# Altium project ECSE478 - DAQ Device.PrjPcb (part 3 of 4)

## Sheet Analog - High Speed DE.SchDoc: Analog - High Speed Differential
size B; DrawnBy: Jasper Yun; SheetNumber: 10; SheetTotal: 13; Competition: SAC 2021; Subteam: Avionics; University: McGill University; Location: Montreal, Quebec; Project: Avionics Project Name; MRT: McGill Rocket Team
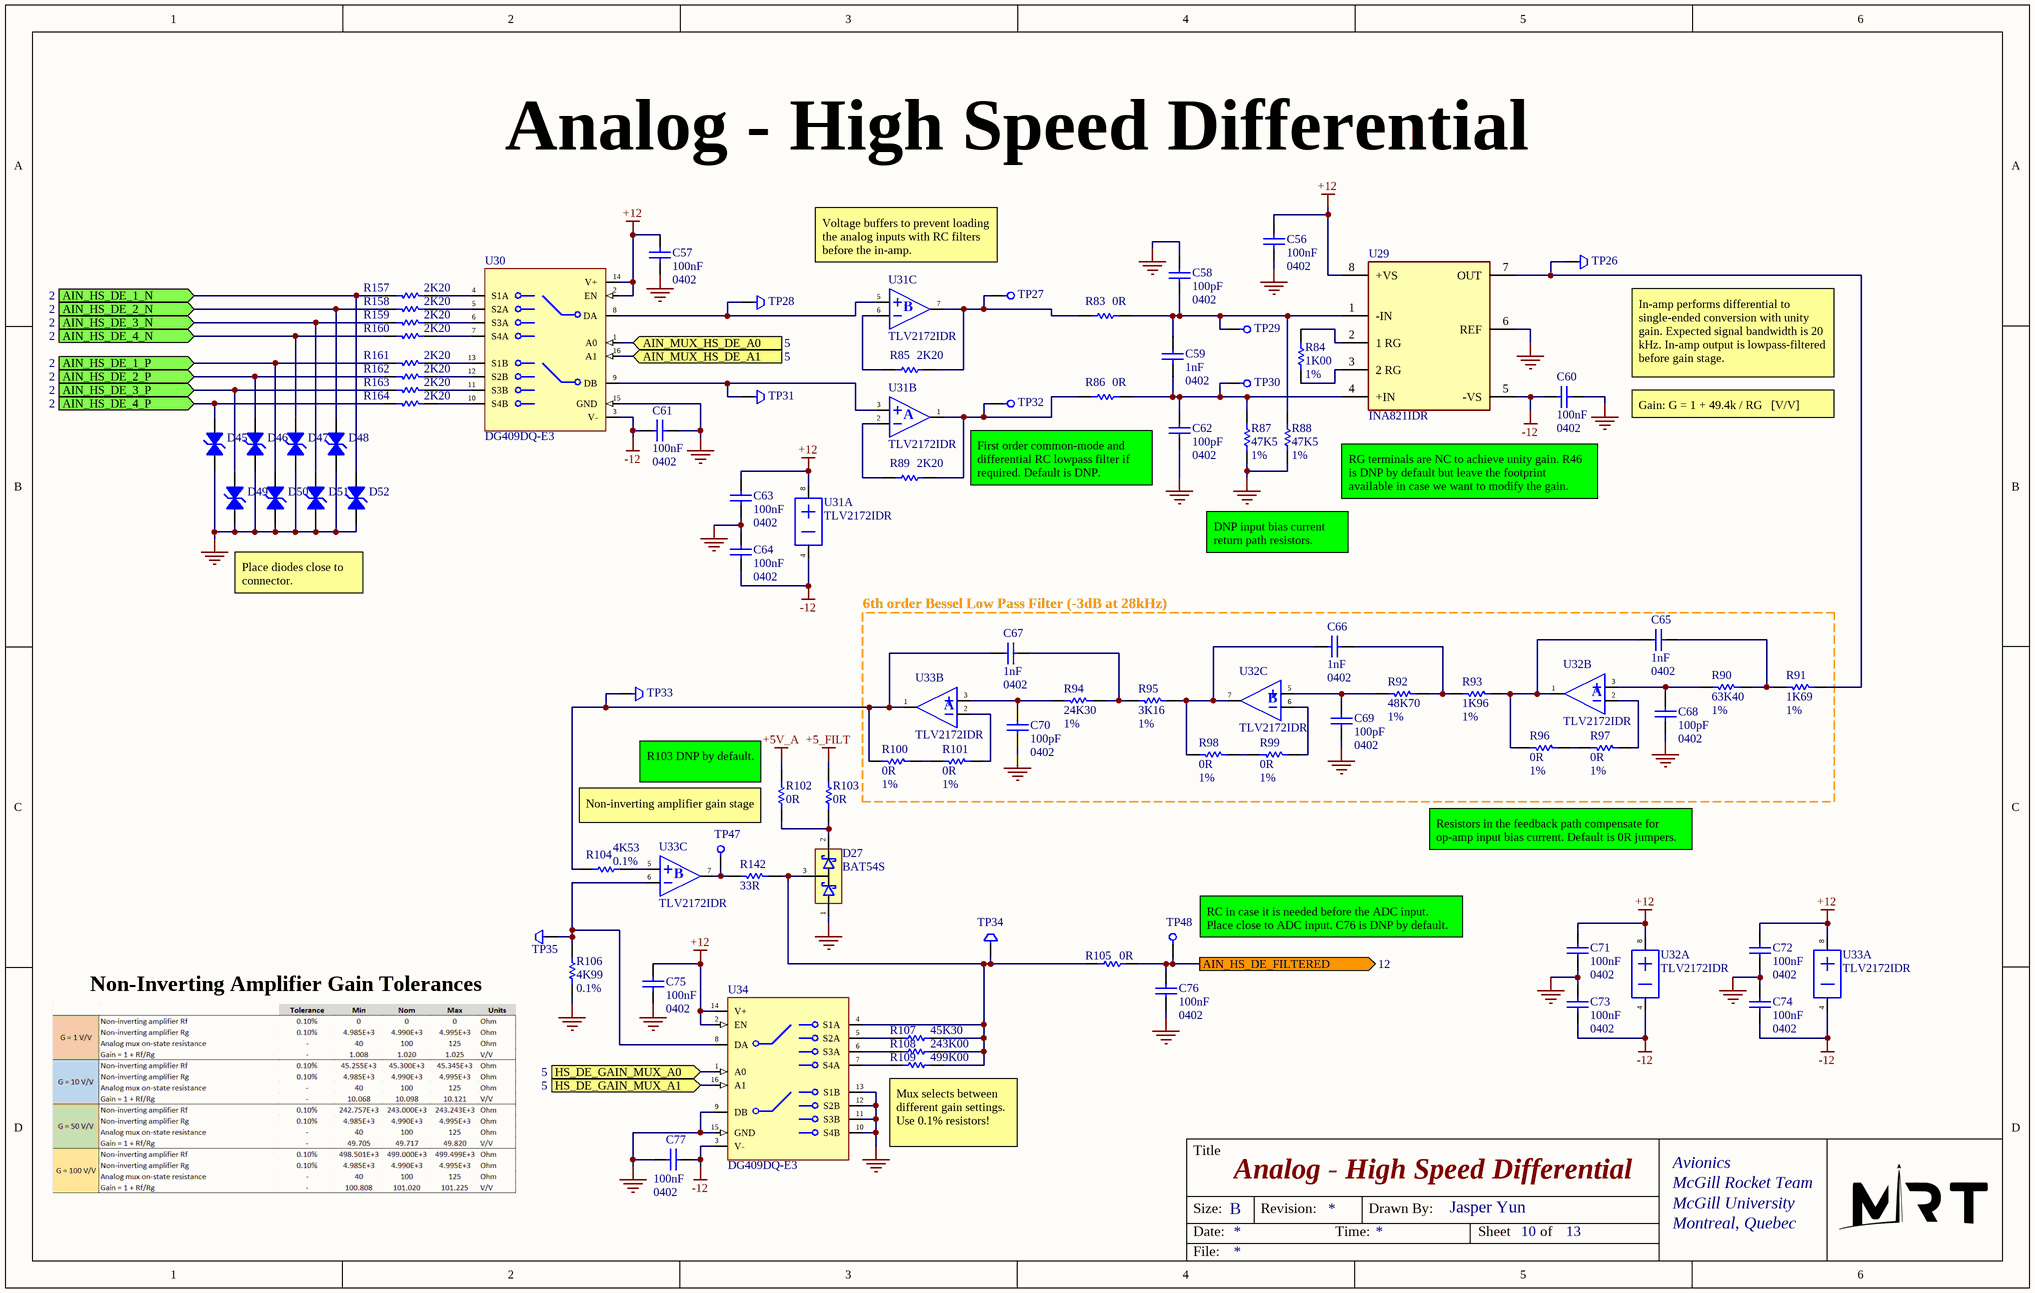
[diagram p9: Analog - High Speed DE.SchDoc]

### Parts
C56  100nF  value 0402  [0402 CAP]
C57  100nF  value 0402  [0402 CAP]
C58  100pF  value 0402  [0402 CAP]
C59  1nF  value 0402  [0402 CAP]
C60  100nF  value 0402  [0402 CAP]
C61  100nF  value 0402  [0402 CAP]
C62  100pF  value 0402  [0402 CAP]
C63  100nF  value 0402  [0402 CAP]
C64  100nF  value 0402  [0402 CAP]
C65  1nF  value 0402  [0402 CAP]
C66  1nF  value 0402  [0402 CAP]
C67  1nF  value 0402  [0402 CAP]
C68  100pF  value 0402  [0402 CAP]
C69  100pF  value 0402  [0402 CAP]
C70  100pF  value 0402  [0402 CAP]
C71  100nF  value 0402  [0402 CAP]
C72  100nF  value 0402  [0402 CAP]
C73  100nF  value 0402  [0402 CAP]
C74  100nF  value 0402  [0402 CAP]
C75  100nF  value 0402  [0402 CAP]
C76  100nF  value 0402  [0402 CAP]
C77  100nF  value 0402  [0402 CAP]
D27  BAT54S  [SOT23-3]
D45  D12V0L1B2LP-7B  [DFN1006-2]  (value not drawn)
D46  D12V0L1B2LP-7B  [DFN1006-2]  (value not drawn)
D47  D12V0L1B2LP-7B  [DFN1006-2]  (value not drawn)
D48  D12V0L1B2LP-7B  [DFN1006-2]  (value not drawn)
D49  D12V0L1B2LP-7B  [DFN1006-2]  (value not drawn)
D50  D12V0L1B2LP-7B  [DFN1006-2]  (value not drawn)
D51  D12V0L1B2LP-7B  [DFN1006-2]  (value not drawn)
D52  D12V0L1B2LP-7B  [DFN1006-2]  (value not drawn)
R83  0R  [0402 RES]
R84  1K00  value 1%  [0402 RES]
R85  2K20  [0402 RES]
R86  0R  [0402 RES]
R87  47K5  value 1%  [0402 RES]
R88  47K5  value 1%  [0402 RES]
R89  2K20  [0402 RES]
R90  63K40  value 1%  [0402 RES]
R91  1K69  value 1%  [0402 RES]
R92  48K70  value 1%  [0402 RES]
R93  1K96  value 1%  [0402 RES]
R94  24K30  value 1%  [0402 RES]
R95  3K16  value 1%  [0402 RES]
R96  0R  value 1%  [0402 RES]
R97  0R  value 1%  [0402 RES]
R98  0R  value 1%  [0402 RES]
R99  0R  value 1%  [0402 RES]
R100  0R  value 1%  [0402 RES]
R101  0R  value 1%  [0402 RES]
R102  0R  [0402 RES]
R103  0R  [0402 RES]
R104  4K53  value 0.1%  [0402 RES]
R105  0R  [0402 RES]
R106  4K99  value 0.1%  [0402 RES]
R107  45K30  [0402 RES]
R108  243K00  [0402 RES]
R109  499K00  [0402 RES]
R142  33R  [0402 RES]
R157  2K20  [0402 RES]
R158  2K20  [0402 RES]
R159  2K20  [0402 RES]
R160  2K20  [0402 RES]
R161  2K20  [0402 RES]
R162  2K20  [0402 RES]
R163  2K20  [0402 RES]
R164  2K20  [0402 RES]
TP26  Test Point - Keystone 5015  [Test Point Keystone 5015]  (value not drawn)
TP27  Test Point - SMD Pad  [TEST POINT SMD PAD]  (value not drawn)  (no BOM)
TP28  Test Point - Keystone 5015  [Test Point Keystone 5015]  (value not drawn)
TP29  Test Point - SMD Pad  [TEST POINT SMD PAD]  (value not drawn)  (no BOM)
TP30  Test Point - SMD Pad  [TEST POINT SMD PAD]  (value not drawn)  (no BOM)
TP31  Test Point - Keystone 5015  [Test Point Keystone 5015]  (value not drawn)
TP32  Test Point - SMD Pad  [TEST POINT SMD PAD]  (value not drawn)  (no BOM)
TP33  Test Point - Keystone 5015  [Test Point Keystone 5015]  (value not drawn)
TP34  Test Point - Keystone 5015  [Test Point Keystone 5015]  (value not drawn)
TP35  Test Point - Keystone 5015  [Test Point Keystone 5015]  (value not drawn)
TP47  Test Point - SMD Pad  [TEST POINT SMD PAD]  (value not drawn)  (no BOM)
TP48  Test Point - SMD Pad  [TEST POINT SMD PAD]  (value not drawn)  (no BOM)
U29  INA821IDR  [FP-D0008A-IPC_A]
U30  DG409DQ-E3  [TSSOP-16]
U31  TLV2172IDR  [SOIC-8]  (parts A,B,C of 3)
U32  TLV2172IDR  [SOIC-8]  (parts A,B,C of 3)
U33  TLV2172IDR  [SOIC-8]  (parts A,B,C of 3)
U34  DG409DQ-E3  [TSSOP-16]

### Blocks framed on the sheet
6th order Bessel Low Pass Filter (-3dB at 28kHz): C65-C70 R90-R101 U32 U33

### Ports
AIN_HS_DE_1_N (in, see 2), AIN_HS_DE_1_P (in, see 2), AIN_HS_DE_2_N (in, see 2), AIN_HS_DE_2_P (in, see 2), AIN_HS_DE_3_N (in, see 2), AIN_HS_DE_3_P (in, see 2), AIN_HS_DE_4_N (in, see 2), AIN_HS_DE_4_P (in, see 2), AIN_HS_DE_FILTERED (out, see 12), AIN_MUX_HS_DE_A0 (in, see 5), AIN_MUX_HS_DE_A1 (in, see 5), HS_DE_GAIN_MUX_A0 (in, see 5), HS_DE_GAIN_MUX_A1 (in, see 5)

### Nets
+5_FILT: R103.1
+5V_A: R102.1
+12: C56.2 C57.2 C63.2 C71.2 C72.2 C75.2 U29.8(+VS) U30.2(EN) U30.14(V+) U31.8(VCC+) U32.8(VCC+) U33.8(VCC+) U34.2(EN) U34.14(V+)
-12: C60.2 C61.2 C64.1 C73.1 C74.1 C77.2 U29.5(-VS) U30.3(V-) U31.4(VCC-) U32.4(VCC-) U33.4(VCC-) U34.3(V-)
GND: C56.1 C57.1 C58.2 C60.1 C61.1 C62.1 C63.1 C64.2 C68.1 C69.1 C70.1 C71.1 C72.1 C73.2 C74.2 C75.1 C76.1 C77.1 D27.1 D45.1 D46.1 D47.1 D48.1 D49.1 D50.1 D51.1 D52.1 R87.1 R88.1 R106.1 U29.6(REF) U30.15(GND) U34.9(DB) U34.10(S4B) U34.11(S3B) U34.12(S2B) U34.13(S1B) U34.15(GND)
AIN_HS_DE_1_N: D52.2 R157.1 ; port AIN_HS_DE_1_N
AIN_HS_DE_1_P: D50.2 R161.1 ; port AIN_HS_DE_1_P
AIN_HS_DE_2_N: D48.2 R158.1 ; port AIN_HS_DE_2_N
AIN_HS_DE_2_P: D46.2 R162.1 ; port AIN_HS_DE_2_P
AIN_HS_DE_3_N: D51.2 R159.1 ; port AIN_HS_DE_3_N
AIN_HS_DE_3_P: D49.2 R163.1 ; port AIN_HS_DE_3_P
AIN_HS_DE_4_N: D47.2 R160.1 ; port AIN_HS_DE_4_N
AIN_HS_DE_4_P: D45.2 R164.1 ; port AIN_HS_DE_4_P
AIN_HS_DE_FILTERED: C76.2 R105.1 TP48.1 ; port AIN_HS_DE_FILTERED
AIN_MUX_HS_DE_A0: U30.1(A0) ; port AIN_MUX_HS_DE_A0
AIN_MUX_HS_DE_A1: U30.16(A1) ; port AIN_MUX_HS_DE_A1
HS_DE_GAIN_MUX_A0: U34.1(A0) ; port HS_DE_GAIN_MUX_A0
HS_DE_GAIN_MUX_A1: U34.16(A1) ; port HS_DE_GAIN_MUX_A1
NetC58_1: C58.1 C59.2 R83.1 R88.2 TP29.1 U29.1(-IN)
NetC59_1: C59.1 C62.2 R86.1 R87.2 TP30.1 U29.4(+IN)
NetC65_1: C65.1 R93.1 R96.2 U32.1
NetC65_2: C65.2 R90.1 R91.2
NetC66_1: C66.1 R95.1 R98.2 U32.7
NetC66_2: C66.2 R92.1 R93.2
NetC67_1: C67.1 R100.2 R104.2 TP33.1 U33.1
NetC67_2: C67.2 R94.1 R95.2
NetC68_2: C68.2 R90.2 U32.3
NetC69_2: C69.2 R92.2 U32.5
NetC70_2: C70.2 R94.2 U33.3
NetD27_2: D27.2 R102.2 R103.2
NetD27_3: D27.3 R105.2 R107.1 R108.1 R109.1 R142.2 TP34.1 U34.4(S1A)
NetR83_2: R83.2 R85.1 TP27.1 U31.7
NetR84_1: R84.1 U29.3(2_RG)
NetR84_2: R84.2 U29.2(1_RG)
NetR85_2: R85.2 U31.6
NetR86_2: R86.2 R89.1 TP32.1 U31.1
NetR89_2: R89.2 U31.2
NetR91_1: R91.1 TP26.1 U29.7(OUT)
NetR96_1: R96.1 R97.2
NetR97_1: R97.1 U32.2
NetR98_1: R98.1 R99.2
NetR99_1: R99.1 U32.6
NetR100_1: R100.1 R101.2
NetR101_1: R101.1 U33.2
NetR104_1: R104.1 U33.5
NetR106_2: R106.2 TP35.1 U33.6 U34.8(DA)
NetR107_2: R107.2 U34.5(S2A)
NetR108_2: R108.2 U34.6(S3A)
NetR109_2: R109.2 U34.7(S4A)
NetR142_1: R142.1 TP47.1 U33.7
NetR157_2: R157.2 U30.4(S1A)
NetR158_2: R158.2 U30.5(S2A)
NetR159_2: R159.2 U30.6(S3A)
NetR160_2: R160.2 U30.7(S4A)
NetR161_2: R161.2 U30.13(S1B)
NetR162_2: R162.2 U30.12(S2B)
NetR163_2: R163.2 U30.11(S3B)
NetR164_2: R164.2 U30.10(S4B)
NetTP28_1: TP28.1 U30.8(DA) U31.5
NetTP31_1: TP31.1 U30.9(DB) U31.3

### Notes on the sheet
- Voltage buffers to prevent loading the analog inputs with RC filters before the in-amp.
- In-amp performs differential to single-ended conversion with unity gain. Expected signal bandwidth is 20 kHz. In-amp output is lowpass-filtered before gain stage.
- Gain: G = 1 + 49.4k / RG   [V/V]
- First order common-mode and differential RC lowpass filter if required. Default is DNP.
- RG terminals are NC to achieve unity gain. R46 is DNP by default but leave the footprint available in case we want to modify the gain.
- DNP input bias current return path resistors.
- Place diodes close to connector.
- (near R102) R103 DNP by default.
- Non-inverting amplifier gain stage
- Resistors in the feedback path compensate for op-amp input bias current. Default is 0R jumpers.
- (near TP48) RC in case it is needed before the ADC input. Place close to ADC input. C76 is DNP by default.
- Non-Inverting Amplifier Gain Tolerances
- (near R109) Mux selects between different gain settings.
  Use 0.1% resistors!
- Title
- Size:
- Date:
- B
- Revision:
- Time:
- Drawn By:
- Sheet
- of
- File:
- (in symbol OP AMP RC4580, part B) A
- (in symbol OP AMP RC4580, part C) B

### Library data of the parts
C56-C77 = Cap: Capacitor; Published: 8-Jun-2000; LatestRevisionDate: 17-Jul-2002; LatestRevisionNote: Re-released for DXP Platform.; PackageReference: RAD-0.3; Publisher: Altium Limited; PackageDescription: Radial Cap, Thru-Hole; 2 Leads; 0.3 in Pin Spacing
D27 = Schottky Diode Array BAT54S: Rectifier Diode Small Signal Schottky 40V 0.3A 5ns 3-Pin SOT-23 T/R; Manufacturer: STMicroelectronics; Manufacturer Part Number: BAT54SFILM; Forward Current: 300mA; Peak Non-Repetitive Surge Current: 1A; Forward Voltage: 900mV; Max Reverse Current: 100uA; Max Reverse Leakage Current: 1uA; Element Configuration: Single; Voltage Rating (DC): 30V; Supplier 1: Digi-Key; RoHS: Yes; Category: Rectifier Diodes; Stock 1: 2760; Pricing 1: 1=0.34000, 10=0.27800, 100=0.14730, 500=0.09694, 1000=0.06592 (USD); Mount: Surface Mount; Case/Package: SOT-23; Number of Pins: 3; Weight: 0.1lb; Min Operating Temperature: -40°C; Max Operating Temperature: 150°C; Reverse Recovery Time: 5ns; Max Repetitive Reverse Voltage (Vrrm): 40V; Packaging: Tape and Reel; Package Quantity: 3000; Average Rectified Current: 300mA; Max Forward Surge Current (Ifsm): 1A; Max Reverse Voltage (DC): 40V; Max Surge Current: 1A; Recovery Time: 5ns; Termination: SMD/SMT; Current Rating: 300mA; Length: 2.9mm; Width: 3.05mm; Height: 0.95mm; Radiation Hardening: No; REACH SVHC: No SVHC; RoHS Compliant: Yes; Lead Free: Lead Free; ComponentLink1URL: https://datasheet.ciiva.com/1200/1689724-1200683.pdf?src-supplier=Farnell; ComponentLink1Description: https://datasheet.ciiva.com/1200/1689724-1200683.pdf?src-supplier=Farnell; ComponentLink2URL: https://datasheet.ciiva.com/1177/1689724-1177974.pdf?src-supplier=Element14; ComponentLink2Description: https://datasheet.ciiva.com/1177/1689724-1177974.pdf?src-supplier=Element14; ComponentLink3URL: https://datasheet.ciiva.com/1200/cd00001322-1200682.pdf?src-supplier=Farnell; ComponentLink3Description: https://datasheet.ciiva.com/1200/cd00001322-1200682.pdf?src-supplier=Farnell; ComponentLink4URL: https://datasheet.ciiva.com/14168/cd00001322-14168028.pdf?src-supplier=Distrelec; ComponentLink4Description: https://datasheet.ciiva.com/14168/cd00001322-14168028.pdf?src-supplier=Distrelec; ComponentLink5URL: https://datasheet.ciiva.com/905/cd00001322-905882.pdf?src-supplier=Digi-Key; ComponentLink5Description: https://datasheet.ciiva.com/905/cd00001322-905882.pdf?src-supplier=Digi-Key; ComponentLink6URL: https://datasheet.ciiva.com/905/cd00001322-905881.pdf?src-supplier=Digi-Key; ComponentLink6Description: https://datasheet.ciiva.com/905/cd00001322-905881.pdf?src-supplier=Digi-Key; ComponentLink7URL: https://datasheet.ciiva.com/905/cd00001322-905883.pdf?src-supplier=Digi-Key; ComponentLink7Description: https://datasheet.ciiva.com/905/cd00001322-905883.pdf?src-supplier=Digi-Key; ComponentLink8URL: https://datasheet.ciiva.com/1177/1689724-1177973.pdf?src-supplier=Element14; ComponentLink8Description: https://datasheet.ciiva.com/1177/1689724-1177973.pdf?src-supplier=Element14; Supplier Part Number 1: 497-2522-1-ND
D45-D52 = Diode Zener Bidirectional: Bidirectional Zener diode
R83 R85 R86 R89 R102 R103 R105 R107-R109 R142 R157-R164 = Res1: Resistor; Value: 1%; Published: 8-Jun-2000; LatestRevisionDate: 17-Jul-2002; LatestRevisionNote: Re-released for DXP Platform.; PackageReference: AXIAL-0.3; Publisher: Altium Limited; PackageDescription: Axial Device, Thru-Hole; 2 Leads; 0.3 in Pin Spacing
R84 R87 R88 R90-R101 R104 R106 = Res1: Resistor; Published: 8-Jun-2000; LatestRevisionDate: 17-Jul-2002; LatestRevisionNote: Re-released for DXP Platform.; PackageReference: AXIAL-0.3; Publisher: Altium Limited; PackageDescription: Axial Device, Thru-Hole; 2 Leads; 0.3 in Pin Spacing
TP26 TP28 TP31 TP33-TP35 = Test Point - Keystone 5015: Keystone 5015 Test point
TP27 TP29 TP30 TP32 TP47 TP48 = Test Point - SMD Pad: SMD Pad test point
U29 = CMP-04895-000157-1: IC INST AMP 1 CIRCUIT 8SOIC; RoHS Compliant: Yes
U30 U34 = Analog Mux DG409DQ-E3: DG409 Series 20 V 8-Ch/Dual 4-Ch High-Performance CMOS Analog Multiplexer; Manufacturer: Vishay Siliconix; Min Supply Voltage: 13V; Max Supply Voltage: 44V; Number of Inputs: 8; Number of Outputs: 2; Number of Channels: 4; Min Dual Supply Voltage: 5V; Max Dual Supply Voltage: 20V; Propagation Delay: 160ns; On-State Resistance: 90R; Operating Supply Current: 1uA; Turn-On Delay Time: 150ns; Max Power Dissipation: 600mW; Max Supply Current: 500uA; Supply Type: Dual,Single; Dual Supply Voltage: 15V; Operating Supply Voltage: 36V; Supplier 1: Mouser; Manufacturer Part Number: DG409DQ-E3; RoHS: Yes; Category: Decoders and Multiplexers; Stock 1: 4584; Pricing 1: 1=4.36000, 10=3.91000, 50=3.70000, 100=3.20000, 1000=2.73000, 10000=2.40000 (USD); Mount: Surface Mount; Case/Package: TSSOP; Number of Pins: 16; Weight: 0.006102oz; Min Operating Temperature: -40°C; Max Operating Temperature: 85°C; Package Quantity: 360; Packaging: Rail/Tube; Logic Function: Multiplexer; Turn-Off Delay Time: 150ns; Power Dissipation: 600mW; Series: -; Length: 5.07mm; Width: 4.4mm; Height: 0.92mm; Radiation Hardening: No; Lead Free: Lead Free; RoHS Compliant: Yes; ComponentLink1URL: https://datasheet.ciiva.com/1677/dg408-1677556.pdf?src-supplier=Digi-Key; ComponentLink1Description: https://datasheet.ciiva.com/1677/dg408-1677556.pdf?src-supplier=Digi-Key; ComponentLink2URL: https://datasheet.ciiva.com/2978/dg408-2978747.pdf?src-supplier=Avnet; ComponentLink2Description: https://datasheet.ciiva.com/2978/dg408-2978747.pdf?src-supplier=Avnet; Supplier Part Number 1: 78-DG409DQ-E3
U31-U33 = OP AMP RC4580: 2-channel, 12-MHz, low-noise, low-distortion audio op amp with high output current 8-SOIC -40 to 85; Manufacturer: Texas Instruments; Manufacturer Part Number: RC4580IDR; Min Supply Voltage: 4V; Max Supply Voltage: 32V; Max Dual Supply Voltage: 16V; Min Dual Supply Voltage: 2V; Voltage Gain: 110dB; Common Mode Rejection Ratio: 80dB; Nominal Gain Bandwidth Product: 12MHz; Number of Channels: 2; Slew Rate: 5V/µs; Max I/O Voltage: 3mV; Input Bias Current: 500nA; Operating Supply Current: 6mA; Output Current per Channel: 50mA; Nominal Supply Current: 4.5mA; Dual Supply Voltage: 9V; Load Impedance: 2kR; Supplier 1: Digi-Key; RoHS: Yes; Category: Amplifiers - Op Amps, Buffer, Instrumentation; Stock 1: 3503; Pricing 1: 1=0.46000, 10=0.37400, 25=0.34200, 100=0.25460, 250=0.23072, 500=0.19092, 1000=0.14320 (USD); Case/Package: D; Number of Pins: 8; Weight: 0.002561oz; Contact Plating: Gold; Min Operating Temperature: -40°C; Max Operating Temperature: 85°C; Packaging: Tape and Reel; Package Quantity: 1; Number of Circuits: 2; Gain Bandwidth Product: 12MHz; Input Offset Voltage (Vos): 3mV; Series: -; Supply Current: 4.5mA; Bandwidth: 12MHz; Unity Gain Bandwidth Product: 12MHz; Number of Elements: 2; Technology: BIPOLAR; Radiation Hardening: No; Lead Free: Lead Free; RoHS Compliant: Yes; Reach SVHC Compliant: No SVHC; ComponentLink1URL: https://datasheet.ciiva.com/23806/1716592-23806563.pdf?src-supplier=Newark; ComponentLink1Description: https://datasheet.ciiva.com/23806/1716592-23806563.pdf?src-supplier=Newark; ComponentLink2URL: https://datasheet.ciiva.com/22654/1882301-22654837.pdf?src-supplier=Element14; ComponentLink2Description: https://datasheet.ciiva.com/22654/1882301-22654837.pdf?src-supplier=Element14; ComponentLink3URL: https://datasheet.ciiva.com/46382/1840282-46382300.pdf?src-supplier=Element14; ComponentLink3Description: https://datasheet.ciiva.com/46382/1840282-46382300.pdf?src-supplier=Element14; ComponentLink4URL: https://datasheet.ciiva.com/1796/rc4580-1796261.pdf?src-supplier=Digi-Key; ComponentLink4Description: https://datasheet.ciiva.com/1796/rc4580-1796261.pdf?src-supplier=Digi-Key; ComponentLink5URL: https://datasheet.ciiva.com/1796/rc4580-1796260.pdf?src-supplier=Digi-Key; ComponentLink5Description: https://datasheet.ciiva.com/1796/rc4580-1796260.pdf?src-supplier=Digi-Key; ComponentLink6URL: https://datasheet.ciiva.com/1796/rc4580-1796262.pdf?src-supplier=Digi-Key; ComponentLink6Description: https://datasheet.ciiva.com/1796/rc4580-1796262.pdf?src-supplier=Digi-Key; Supplier Part Number 1: 296-15367-1-ND

## Sheet Analog - Low Speed SE.SchDoc: Analog - Low Speed Single-Ended
size B; DrawnBy: Jasper Yun; SheetNumber: 11; SheetTotal: 13; Competition: SAC 2021; Subteam: Avionics; University: McGill University; Location: Montreal, Quebec; Project: Avionics Project Name; MRT: McGill Rocket Team
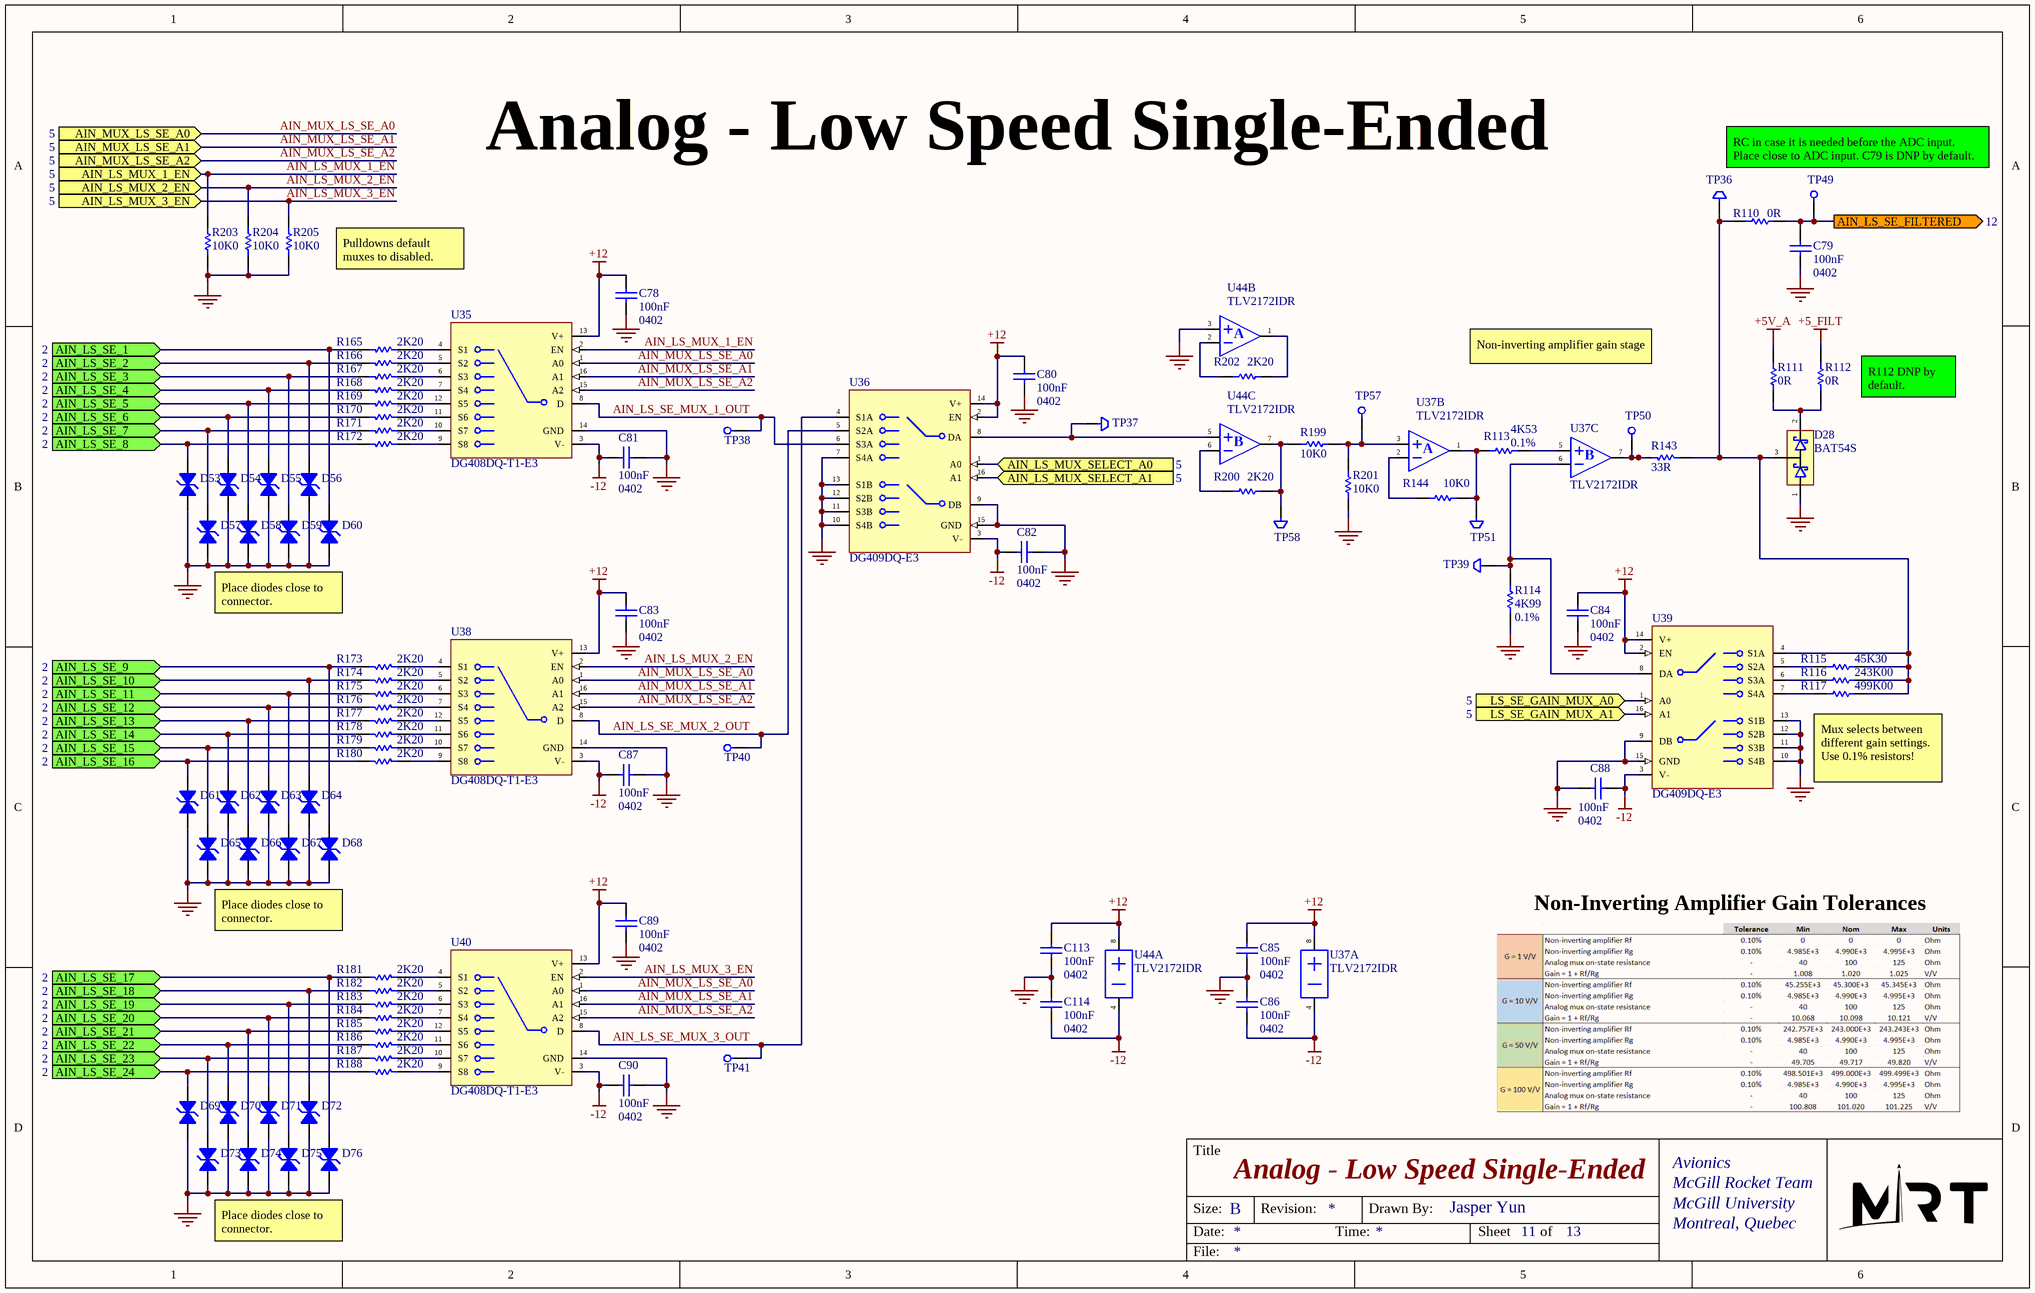
[diagram p10: Analog - Low Speed SE.SchDoc]

### Parts
C78  100nF  value 0402  [0402 CAP]
C79  100nF  value 0402  [0402 CAP]
C80  100nF  value 0402  [0402 CAP]
C81  100nF  value 0402  [0402 CAP]
C82  100nF  value 0402  [0402 CAP]
C83  100nF  value 0402  [0402 CAP]
C84  100nF  value 0402  [0402 CAP]
C85  100nF  value 0402  [0402 CAP]
C86  100nF  value 0402  [0402 CAP]
C87  100nF  value 0402  [0402 CAP]
C88  100nF  value 0402  [0402 CAP]
C89  100nF  value 0402  [0402 CAP]
C90  100nF  value 0402  [0402 CAP]
C113  100nF  value 0402  [0402 CAP]
C114  100nF  value 0402  [0402 CAP]
D28  BAT54S  [SOT23-3]
D53  D12V0L1B2LP-7B  [DFN1006-2]  (value not drawn)
D54  D12V0L1B2LP-7B  [DFN1006-2]  (value not drawn)
D55  D12V0L1B2LP-7B  [DFN1006-2]  (value not drawn)
D56  D12V0L1B2LP-7B  [DFN1006-2]  (value not drawn)
D57  D12V0L1B2LP-7B  [DFN1006-2]  (value not drawn)
D58  D12V0L1B2LP-7B  [DFN1006-2]  (value not drawn)
D59  D12V0L1B2LP-7B  [DFN1006-2]  (value not drawn)
D60  D12V0L1B2LP-7B  [DFN1006-2]  (value not drawn)
D61  D12V0L1B2LP-7B  [DFN1006-2]  (value not drawn)
D62  D12V0L1B2LP-7B  [DFN1006-2]  (value not drawn)
D63  D12V0L1B2LP-7B  [DFN1006-2]  (value not drawn)
D64  D12V0L1B2LP-7B  [DFN1006-2]  (value not drawn)
D65  D12V0L1B2LP-7B  [DFN1006-2]  (value not drawn)
D66  D12V0L1B2LP-7B  [DFN1006-2]  (value not drawn)
D67  D12V0L1B2LP-7B  [DFN1006-2]  (value not drawn)
D68  D12V0L1B2LP-7B  [DFN1006-2]  (value not drawn)
D69  D12V0L1B2LP-7B  [DFN1006-2]  (value not drawn)
D70  D12V0L1B2LP-7B  [DFN1006-2]  (value not drawn)
D71  D12V0L1B2LP-7B  [DFN1006-2]  (value not drawn)
D72  D12V0L1B2LP-7B  [DFN1006-2]  (value not drawn)
D73  D12V0L1B2LP-7B  [DFN1006-2]  (value not drawn)
D74  D12V0L1B2LP-7B  [DFN1006-2]  (value not drawn)
D75  D12V0L1B2LP-7B  [DFN1006-2]  (value not drawn)
D76  D12V0L1B2LP-7B  [DFN1006-2]  (value not drawn)
R110  0R  [0402 RES]
R111  0R  [0402 RES]
R112  0R  [0402 RES]
R113  4K53  value 0.1%  [0402 RES]
R114  4K99  value 0.1%  [0402 RES]
R115  45K30  [0402 RES]
R116  243K00  [0402 RES]
R117  499K00  [0402 RES]
R143  33R  [0402 RES]
R144  10K0  [0402 RES]
R165  2K20  [0402 RES]
R166  2K20  [0402 RES]
R167  2K20  [0402 RES]
R168  2K20  [0402 RES]
R169  2K20  [0402 RES]
R170  2K20  [0402 RES]
R171  2K20  [0402 RES]
R172  2K20  [0402 RES]
R173  2K20  [0402 RES]
R174  2K20  [0402 RES]
R175  2K20  [0402 RES]
R176  2K20  [0402 RES]
R177  2K20  [0402 RES]
R178  2K20  [0402 RES]
R179  2K20  [0402 RES]
R180  2K20  [0402 RES]
R181  2K20  [0402 RES]
R182  2K20  [0402 RES]
R183  2K20  [0402 RES]
R184  2K20  [0402 RES]
R185  2K20  [0402 RES]
R186  2K20  [0402 RES]
R187  2K20  [0402 RES]
R188  2K20  [0402 RES]
R199  10K0  [0402 RES]
R200  2K20  [0402 RES]
R201  10K0  [0402 RES]
R202  2K20  [0402 RES]
R203  10K0  [0402 RES]
R204  10K0  [0402 RES]
R205  10K0  [0402 RES]
TP36  Test Point - Keystone 5015  [Test Point Keystone 5015]  (value not drawn)
TP37  Test Point - Keystone 5015  [Test Point Keystone 5015]  (value not drawn)
TP38  Test Point - SMD Pad  [TEST POINT SMD PAD]  (value not drawn)  (no BOM)
TP39  Test Point - Keystone 5015  [Test Point Keystone 5015]  (value not drawn)
TP40  Test Point - SMD Pad  [TEST POINT SMD PAD]  (value not drawn)  (no BOM)
TP41  Test Point - SMD Pad  [TEST POINT SMD PAD]  (value not drawn)  (no BOM)
TP49  Test Point - SMD Pad  [TEST POINT SMD PAD]  (value not drawn)  (no BOM)
TP50  Test Point - SMD Pad  [TEST POINT SMD PAD]  (value not drawn)  (no BOM)
TP51  Test Point - Keystone 5015  [Test Point Keystone 5015]  (value not drawn)
TP57  Test Point - SMD Pad  [TEST POINT SMD PAD]  (value not drawn)  (no BOM)
TP58  Test Point - Keystone 5015  [Test Point Keystone 5015]  (value not drawn)
U35  DG408DQ-T1-E3  [TSSOP-16]
U36  DG409DQ-E3  [TSSOP-16]
U37  TLV2172IDR  [SOIC-8]  (parts A,B,C of 3)
U38  DG408DQ-T1-E3  [TSSOP-16]
U39  DG409DQ-E3  [TSSOP-16]
U40  DG408DQ-T1-E3  [TSSOP-16]
U44  TLV2172IDR  [SOIC-8]  (parts A,B,C of 3)

### Ports
AIN_LS_MUX_1_EN (in, see 5), AIN_LS_MUX_2_EN (in, see 5), AIN_LS_MUX_3_EN (in, see 5), AIN_LS_MUX_SELECT_A0 (in, see 5), AIN_LS_MUX_SELECT_A1 (in, see 5), AIN_LS_SE_1 (in, see 2), AIN_LS_SE_2 (in, see 2), AIN_LS_SE_3 (in, see 2), AIN_LS_SE_4 (in, see 2), AIN_LS_SE_5 (in, see 2), AIN_LS_SE_6 (in, see 2), AIN_LS_SE_7 (in, see 2), AIN_LS_SE_8 (in, see 2), AIN_LS_SE_9 (in, see 2), AIN_LS_SE_10 (in, see 2), AIN_LS_SE_11 (in, see 2), AIN_LS_SE_12 (in, see 2), AIN_LS_SE_13 (in, see 2), AIN_LS_SE_14 (in, see 2), AIN_LS_SE_15 (in, see 2), AIN_LS_SE_16 (in, see 2), AIN_LS_SE_17 (in, see 2), AIN_LS_SE_18 (in, see 2), AIN_LS_SE_19 (in, see 2), AIN_LS_SE_20 (in, see 2), AIN_LS_SE_21 (in, see 2), AIN_LS_SE_22 (in, see 2), AIN_LS_SE_23 (in, see 2), AIN_LS_SE_24 (in, see 2), AIN_LS_SE_FILTERED (out, see 12), AIN_MUX_LS_SE_A0 (in, see 5), AIN_MUX_LS_SE_A1 (in, see 5), AIN_MUX_LS_SE_A2 (in, see 5), LS_SE_GAIN_MUX_A0 (in, see 5), LS_SE_GAIN_MUX_A1 (in, see 5)

### Nets
+5_FILT: R112.1
+5V_A: R111.1
+12: C78.2 C80.2 C83.2 C84.2 C85.2 C89.2 C113.2 U35.13(V+) U36.2(EN) U36.14(V+) U37.8(VCC+) U38.13(V+) U39.2(EN) U39.14(V+) U40.13(V+) U44.8(VCC+)
-12: C81.2 C82.2 C86.1 C87.2 C88.2 C90.2 C114.1 U35.3(V-) U36.3(V-) U37.4(VCC-) U38.3(V-) U39.3(V-) U40.3(V-) U44.4(VCC-)
GND: C78.1 C79.1 C80.1 C81.1 C82.1 C83.1 C84.1 C85.1 C86.2 C87.1 C88.1 C89.1 C90.1 C113.1 C114.2 D28.1 D53.1 D54.1 D55.1 D56.1 D57.1 D58.1 D59.1 D60.1 D61.1 D62.1 D63.1 D64.1 D65.1 D66.1 D67.1 D68.1 D69.1 D70.1 D71.1 D72.1 D73.1 D74.1 D75.1 D76.1 R114.1 R201.1 R203.2 R204.2 R205.2 U35.14(GND) U36.7(S4A) U36.9(DB) U36.10(S4B) U36.11(S3B) U36.12(S2B) U36.13(S1B) U36.15(GND) U38.14(GND) U39.9(DB) U39.10(S4B) U39.11(S3B) U39.12(S2B) U39.13(S1B) U39.15(GND) U40.14(GND) U44.3
AIN_LS_MUX_1_EN: R203.1 U35.2(EN) ; port AIN_LS_MUX_1_EN
AIN_LS_MUX_2_EN: R204.1 U38.2(EN) ; port AIN_LS_MUX_2_EN
AIN_LS_MUX_3_EN: R205.1 U40.2(EN) ; port AIN_LS_MUX_3_EN
AIN_LS_MUX_SELECT_A0: U36.1(A0) ; port AIN_LS_MUX_SELECT_A0
AIN_LS_MUX_SELECT_A1: U36.16(A1) ; port AIN_LS_MUX_SELECT_A1
AIN_LS_SE_1: D60.2 R165.1 ; port AIN_LS_SE_1
AIN_LS_SE_2: D56.2 R166.1 ; port AIN_LS_SE_2
AIN_LS_SE_3: D59.2 R167.1 ; port AIN_LS_SE_3
AIN_LS_SE_4: D55.2 R168.1 ; port AIN_LS_SE_4
AIN_LS_SE_5: D58.2 R169.1 ; port AIN_LS_SE_5
AIN_LS_SE_6: D54.2 R170.1 ; port AIN_LS_SE_6
AIN_LS_SE_7: D57.2 R171.1 ; port AIN_LS_SE_7
AIN_LS_SE_8: D53.2 R172.1 ; port AIN_LS_SE_8
AIN_LS_SE_9: D68.2 R173.1 ; port AIN_LS_SE_9
AIN_LS_SE_10: D64.2 R174.1 ; port AIN_LS_SE_10
AIN_LS_SE_11: D67.2 R175.1 ; port AIN_LS_SE_11
AIN_LS_SE_12: D63.2 R176.1 ; port AIN_LS_SE_12
AIN_LS_SE_13: D66.2 R177.1 ; port AIN_LS_SE_13
AIN_LS_SE_14: D62.2 R178.1 ; port AIN_LS_SE_14
AIN_LS_SE_15: D65.2 R179.1 ; port AIN_LS_SE_15
AIN_LS_SE_16: D61.2 R180.1 ; port AIN_LS_SE_16
AIN_LS_SE_17: D76.2 R181.1 ; port AIN_LS_SE_17
AIN_LS_SE_18: D72.2 R182.1 ; port AIN_LS_SE_18
AIN_LS_SE_19: D75.2 R183.1 ; port AIN_LS_SE_19
AIN_LS_SE_20: D71.2 R184.1 ; port AIN_LS_SE_20
AIN_LS_SE_21: D74.2 R185.1 ; port AIN_LS_SE_21
AIN_LS_SE_22: D70.2 R186.1 ; port AIN_LS_SE_22
AIN_LS_SE_23: D73.2 R187.1 ; port AIN_LS_SE_23
AIN_LS_SE_24: D69.2 R188.1 ; port AIN_LS_SE_24
AIN_LS_SE_FILTERED: C79.2 R110.1 TP49.1 ; port AIN_LS_SE_FILTERED
AIN_LS_SE_MUX_1_OUT: TP38.1 U35.8(D) U36.6(S3A)
AIN_LS_SE_MUX_2_OUT: TP40.1 U36.5(S2A) U38.8(D)
AIN_LS_SE_MUX_3_OUT: TP41.1 U36.4(S1A) U40.8(D)
AIN_MUX_LS_SE_A0: U35.1(A0) U38.1(A0) U40.1(A0) ; port AIN_MUX_LS_SE_A0
AIN_MUX_LS_SE_A1: U35.16(A1) U38.16(A1) U40.16(A1) ; port AIN_MUX_LS_SE_A1
AIN_MUX_LS_SE_A2: U35.15(A2) U38.15(A2) U40.15(A2) ; port AIN_MUX_LS_SE_A2
LS_SE_GAIN_MUX_A0: U39.1(A0) ; port LS_SE_GAIN_MUX_A0
LS_SE_GAIN_MUX_A1: U39.16(A1) ; port LS_SE_GAIN_MUX_A1
NetD28_2: D28.2 R111.2 R112.2
NetD28_3: D28.3 R110.2 R115.1 R116.1 R117.1 R143.2 TP36.1 U39.4(S1A)
NetR113_1: R113.1 U37.5
NetR113_2: R113.2 R144.1 TP51.1 U37.1
NetR114_2: R114.2 TP39.1 U37.6 U39.8(DA)
NetR115_2: R115.2 U39.5(S2A)
NetR116_2: R116.2 U39.6(S3A)
NetR117_2: R117.2 U39.7(S4A)
NetR143_1: R143.1 TP50.1 U37.7
NetR144_2: R144.2 U37.2
NetR165_2: R165.2 U35.4(S1)
NetR166_2: R166.2 U35.5(S2)
NetR167_2: R167.2 U35.6(S3)
NetR168_2: R168.2 U35.7(S4)
NetR169_2: R169.2 U35.12(S5)
NetR170_2: R170.2 U35.11(S6)
NetR171_2: R171.2 U35.10(S7)
NetR172_2: R172.2 U35.9(S8)
NetR173_2: R173.2 U38.4(S1)
NetR174_2: R174.2 U38.5(S2)
NetR175_2: R175.2 U38.6(S3)
NetR176_2: R176.2 U38.7(S4)
NetR177_2: R177.2 U38.12(S5)
NetR178_2: R178.2 U38.11(S6)
NetR179_2: R179.2 U38.10(S7)
NetR180_2: R180.2 U38.9(S8)
NetR181_2: R181.2 U40.4(S1)
NetR182_2: R182.2 U40.5(S2)
NetR183_2: R183.2 U40.6(S3)
NetR184_2: R184.2 U40.7(S4)
NetR185_2: R185.2 U40.12(S5)
NetR186_2: R186.2 U40.11(S6)
NetR187_2: R187.2 U40.10(S7)
NetR188_2: R188.2 U40.9(S8)
NetR199_1: R199.1 R201.2 TP57.1 U37.3
NetR199_2: R199.2 R200.1 TP58.1 U44.7
NetR200_2: R200.2 U44.6
NetR202_1: R202.1 U44.1
NetR202_2: R202.2 U44.2
NetTP37_1: TP37.1 U36.8(DA) U44.5

### Notes on the sheet
- RC in case it is needed before the ADC input. Place close to ADC input. C79 is DNP by default.
- Pulldowns default muxes to disabled.
- Non-inverting amplifier gain stage
- (near R112) R112 DNP by default.
- Place diodes close to connector.
- Mux selects between different gain settings.
  Use 0.1% resistors!
- Non-Inverting Amplifier Gain Tolerances
- Title
- Size:
- Date:
- B
- Revision:
- Time:
- Drawn By:
- Sheet
- of
- File:
- (in symbol OP AMP RC4580, part B) A
- (in symbol OP AMP RC4580, part C) B

### Library data of the parts
C78-C90 C113 C114 = Cap: Capacitor; Published: 8-Jun-2000; LatestRevisionDate: 17-Jul-2002; LatestRevisionNote: Re-released for DXP Platform.; PackageReference: RAD-0.3; Publisher: Altium Limited; PackageDescription: Radial Cap, Thru-Hole; 2 Leads; 0.3 in Pin Spacing
D28 = Schottky Diode Array BAT54S: as D27 on sheet Analog - High Speed DE; Supplier 1: Digi-Key; RoHS: Yes; Category: Rectifier Diodes; Stock 1: 2760; Pricing 1: 1=0.34000, 10=0.27800, 100=0.14730, 500=0.09694, 1000=0.06592 (USD); Mount: Surface Mount; Case/Package: SOT-23; Number of Pins: 3; Weight: 0.1lb; Min Operating Temperature: -40°C; Max Operating Temperature: 150°C; Reverse Recovery Time: 5ns; Max Repetitive Reverse Voltage (Vrrm): 40V; Packaging: Tape and Reel; Package Quantity: 3000; Average Rectified Current: 300mA; Max Forward Surge Current (Ifsm): 1A; Max Reverse Voltage (DC): 40V; Max Surge Current: 1A; Recovery Time: 5ns; Termination: SMD/SMT; Current Rating: 300mA; Length: 2.9mm; Width: 3.05mm; Height: 0.95mm; Radiation Hardening: No; REACH SVHC: No SVHC; RoHS Compliant: Yes; Lead Free: Lead Free; ComponentLink1URL: https://datasheet.ciiva.com/1200/1689724-1200683.pdf?src-supplier=Farnell; ComponentLink1Description: https://datasheet.ciiva.com/1200/1689724-1200683.pdf?src-supplier=Farnell; ComponentLink2URL: https://datasheet.ciiva.com/1177/1689724-1177974.pdf?src-supplier=Element14; ComponentLink2Description: https://datasheet.ciiva.com/1177/1689724-1177974.pdf?src-supplier=Element14; ComponentLink3URL: https://datasheet.ciiva.com/1200/cd00001322-1200682.pdf?src-supplier=Farnell; ComponentLink3Description: https://datasheet.ciiva.com/1200/cd00001322-1200682.pdf?src-supplier=Farnell; ComponentLink4URL: https://datasheet.ciiva.com/14168/cd00001322-14168028.pdf?src-supplier=Distrelec; ComponentLink4Description: https://datasheet.ciiva.com/14168/cd00001322-14168028.pdf?src-supplier=Distrelec; ComponentLink5URL: https://datasheet.ciiva.com/905/cd00001322-905882.pdf?src-supplier=Digi-Key; ComponentLink5Description: https://datasheet.ciiva.com/905/cd00001322-905882.pdf?src-supplier=Digi-Key; ComponentLink6URL: https://datasheet.ciiva.com/905/cd00001322-905881.pdf?src-supplier=Digi-Key; ComponentLink6Description: https://datasheet.ciiva.com/905/cd00001322-905881.pdf?src-supplier=Digi-Key; ComponentLink7URL: https://datasheet.ciiva.com/905/cd00001322-905883.pdf?src-supplier=Digi-Key; ComponentLink7Description: https://datasheet.ciiva.com/905/cd00001322-905883.pdf?src-supplier=Digi-Key; ComponentLink8URL: https://datasheet.ciiva.com/1177/1689724-1177973.pdf?src-supplier=Element14; ComponentLink8Description: https://datasheet.ciiva.com/1177/1689724-1177973.pdf?src-supplier=Element14; Supplier Part Number 1: 497-2522-1-ND
D53-D76 = Diode Zener Bidirectional: Bidirectional Zener diode
R110-R112 R115-R117 R143 R144 R165-R188 R199-R205 = Res1: Resistor; Value: 1%; Published: 8-Jun-2000; LatestRevisionDate: 17-Jul-2002; LatestRevisionNote: Re-released for DXP Platform.; PackageReference: AXIAL-0.3; Publisher: Altium Limited; PackageDescription: Axial Device, Thru-Hole; 2 Leads; 0.3 in Pin Spacing
R113 R114 = Res1: Resistor; Published: 8-Jun-2000; LatestRevisionDate: 17-Jul-2002; LatestRevisionNote: Re-released for DXP Platform.; PackageReference: AXIAL-0.3; Publisher: Altium Limited; PackageDescription: Axial Device, Thru-Hole; 2 Leads; 0.3 in Pin Spacing
TP36 TP37 TP39 TP51 TP58 = Test Point - Keystone 5015: Keystone 5015 Test point
TP38 TP40 TP41 TP49 TP50 TP57 = Test Point - SMD Pad: SMD Pad test point
U35 U38 U40 = Analog Mux DG408DQ-T1-E3: DG408DQ-T1-E3; Multiplexer Single 8: 1; 15 V; 18 V; 24 V; 28 V; 16-Pin TSSOP; Manufacturer: Vishay Siliconix; Min Supply Voltage: 13V; Max Supply Voltage: 44V; Number of Inputs: 8; Number of Outputs: 1; Operating Supply Voltage: 36V; Propagation Delay: 160ns; Max Power Dissipation: 600mW; Min Dual Supply Voltage: 5V; Max Dual Supply Voltage: 20V; Dual Supply Voltage: 15V; On-State Resistance: 90R; Turn-On Delay Time: 150ns; Max Supply Current: 500uA; Operating Supply Current: 1uA; Supply Type: Single,Dual; Nominal Supply Current: 10uA; High Level Output Current: 30mA; Supplier 1: RSComponents; Manufacturer Part Number: DG408DQ-T1-E3; RoHS: Yes; Category: Decoders and Multiplexers; Stock 1: 2985; Pricing 1: 5=2.69000, 50=2.02000, 250=1.57000 (GBP); Mount: Surface Mount; Case/Package: TSSOP; Number of Pins: 16; Weight: 0.006102oz; Contact Plating: Tin,Matte; Min Operating Temperature: -40°C; Max Operating Temperature: 85°C; Packaging: Tape and Reel; Number of Channels: 8; Package Quantity: 1; Turn-Off Delay Time: 150ns; Logic Function: Multiplexer; Power Dissipation: 600mW; Number of Circuits: 1; Series: -; Supply Current: 10uA; Length: 5.07mm; Width: 4.4mm; Height: 0.92mm; Radiation Hardening: No; Reach SVHC Compliant: Unknown; Lead Free: Lead Free; RoHS Compliant: Yes; ComponentLink1URL: https://datasheet.ciiva.com/15127/getdatasheetpartid-99309-15127097.pdf?src-supplier=Verical; ComponentLink1Description: https://datasheet.ciiva.com/15127/getdatasheetpartid-99309-15127097.pdf?src-supplier=Verical; ComponentLink2URL: https://datasheet.ciiva.com/11499/dg408-11499135.pdf?src-supplier=Avnet; ComponentLink2Description: https://datasheet.ciiva.com/11499/dg408-11499135.pdf?src-supplier=Avnet; ComponentLink3URL: https://datasheet.ciiva.com/1666/dg408-1666717.pdf?src-supplier=Digi-Key; ComponentLink3Description: https://datasheet.ciiva.com/1666/dg408-1666717.pdf?src-supplier=Digi-Key; ComponentLink4URL: https://datasheet.ciiva.com/1666/dg408-1666718.pdf?src-supplier=Digi-Key; ComponentLink4Description: https://datasheet.ciiva.com/1666/dg408-1666718.pdf?src-supplier=Digi-Key; ComponentLink5URL: https://datasheet.ciiva.com/1666/dg408-1666719.pdf?src-supplier=Digi-Key; ComponentLink5Description: https://datasheet.ciiva.com/1666/dg408-1666719.pdf?src-supplier=Digi-Key; Supplier Part Number 1: 2509481281
U36 U39 = Analog Mux DG409DQ-E3: as U30 on sheet Analog - High Speed DE; Supplier 1: Mouser; Manufacturer Part Number: DG409DQ-E3; RoHS: Yes; Category: Decoders and Multiplexers; Stock 1: 4584; Pricing 1: 1=4.36000, 10=3.91000, 50=3.70000, 100=3.20000, 1000=2.73000, 10000=2.40000 (USD); Mount: Surface Mount; Case/Package: TSSOP; Number of Pins: 16; Weight: 0.006102oz; Min Operating Temperature: -40°C; Max Operating Temperature: 85°C; Package Quantity: 360; Packaging: Rail/Tube; Logic Function: Multiplexer; Turn-Off Delay Time: 150ns; Power Dissipation: 600mW; Series: -; Length: 5.07mm; Width: 4.4mm; Height: 0.92mm; Radiation Hardening: No; Lead Free: Lead Free; RoHS Compliant: Yes; ComponentLink1URL: https://datasheet.ciiva.com/1677/dg408-1677556.pdf?src-supplier=Digi-Key; ComponentLink1Description: https://datasheet.ciiva.com/1677/dg408-1677556.pdf?src-supplier=Digi-Key; ComponentLink2URL: https://datasheet.ciiva.com/2978/dg408-2978747.pdf?src-supplier=Avnet; ComponentLink2Description: https://datasheet.ciiva.com/2978/dg408-2978747.pdf?src-supplier=Avnet; Supplier Part Number 1: 78-DG409DQ-E3
U37 U44 = OP AMP RC4580: as U31 on sheet Analog - High Speed DE; Supplier 1: Digi-Key; RoHS: Yes; Category: Amplifiers - Op Amps, Buffer, Instrumentation; Stock 1: 3503; Pricing 1: 1=0.46000, 10=0.37400, 25=0.34200, 100=0.25460, 250=0.23072, 500=0.19092, 1000=0.14320 (USD); Case/Package: D; Number of Pins: 8; Weight: 0.002561oz; Contact Plating: Gold; Min Operating Temperature: -40°C; Max Operating Temperature: 85°C; Packaging: Tape and Reel; Package Quantity: 1; Number of Circuits: 2; Gain Bandwidth Product: 12MHz; Input Offset Voltage (Vos): 3mV; Series: -; Supply Current: 4.5mA; Bandwidth: 12MHz; Unity Gain Bandwidth Product: 12MHz; Number of Elements: 2; Technology: BIPOLAR; Radiation Hardening: No; Lead Free: Lead Free; RoHS Compliant: Yes; Reach SVHC Compliant: No SVHC; ComponentLink1URL: https://datasheet.ciiva.com/23806/1716592-23806563.pdf?src-supplier=Newark; ComponentLink1Description: https://datasheet.ciiva.com/23806/1716592-23806563.pdf?src-supplier=Newark; ComponentLink2URL: https://datasheet.ciiva.com/22654/1882301-22654837.pdf?src-supplier=Element14; ComponentLink2Description: https://datasheet.ciiva.com/22654/1882301-22654837.pdf?src-supplier=Element14; ComponentLink3URL: https://datasheet.ciiva.com/46382/1840282-46382300.pdf?src-supplier=Element14; ComponentLink3Description: https://datasheet.ciiva.com/46382/1840282-46382300.pdf?src-supplier=Element14; ComponentLink4URL: https://datasheet.ciiva.com/1796/rc4580-1796261.pdf?src-supplier=Digi-Key; ComponentLink4Description: https://datasheet.ciiva.com/1796/rc4580-1796261.pdf?src-supplier=Digi-Key; ComponentLink5URL: https://datasheet.ciiva.com/1796/rc4580-1796260.pdf?src-supplier=Digi-Key; ComponentLink5Description: https://datasheet.ciiva.com/1796/rc4580-1796260.pdf?src-supplier=Digi-Key; ComponentLink6URL: https://datasheet.ciiva.com/1796/rc4580-1796262.pdf?src-supplier=Digi-Key; ComponentLink6Description: https://datasheet.ciiva.com/1796/rc4580-1796262.pdf?src-supplier=Digi-Key; Supplier Part Number 1: 296-15367-1-ND

## Sheet ADC.SchDoc: Analog to Digital Conversion
size B; DrawnBy: Jasper Yun; SheetNumber: 12; SheetTotal: 13; Competition: SAC 2021; Subteam: Avionics; University: McGill University; Location: Montreal, Quebec; Project: Avionics Project Name; MRT: McGill Rocket Team
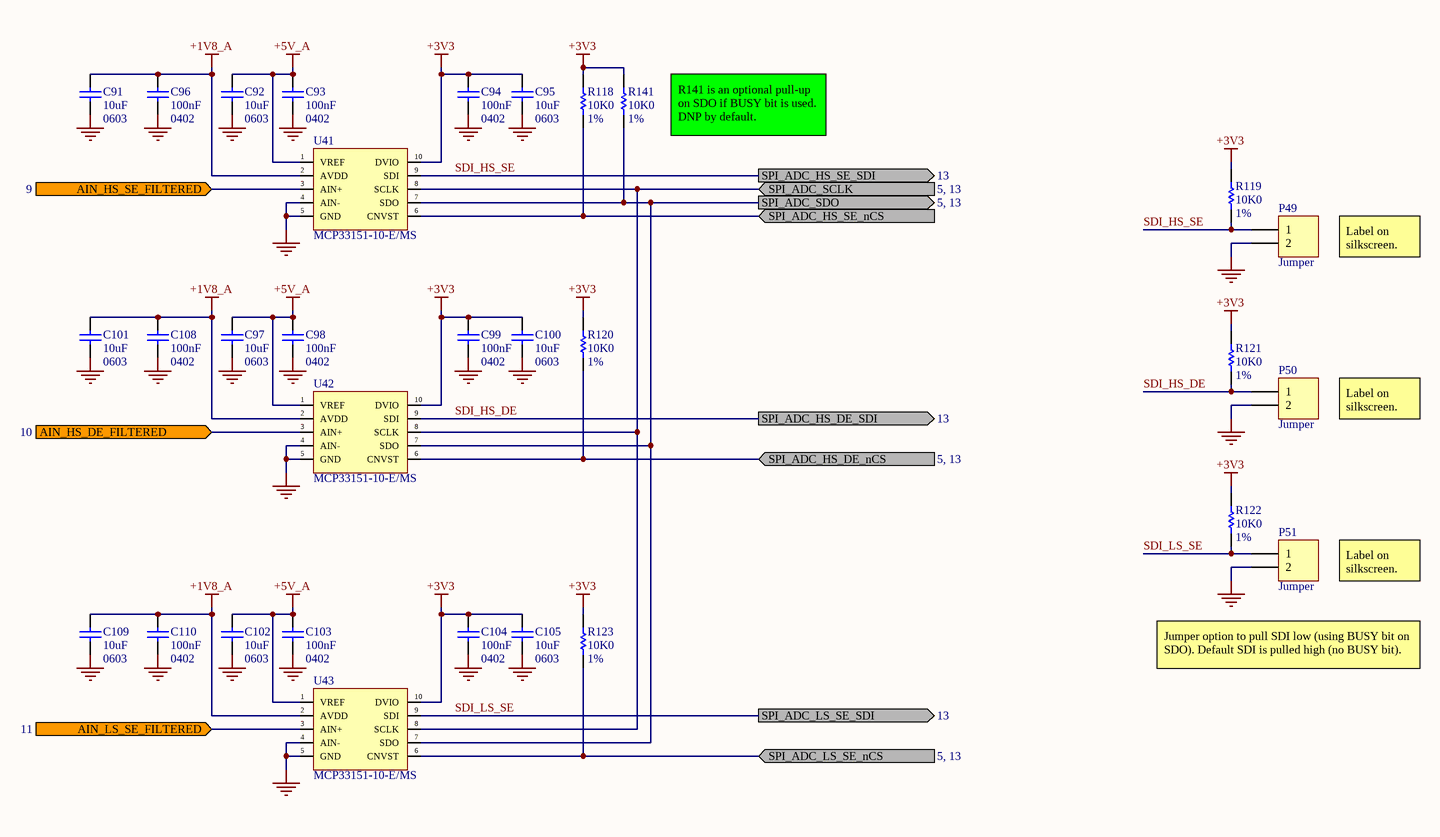
[diagram p11: ADC.SchDoc]

### Parts
C91  10uF  value 0603  [0603 CAP SAMSUNG CL10C]
C92  10uF  value 0603  [0603 CAP SAMSUNG CL10C]
C93  100nF  value 0402  [0402 CAP]
C94  100nF  value 0402  [0402 CAP]
C95  10uF  value 0603  [0603 CAP SAMSUNG CL10C]
C96  100nF  value 0402  [0402 CAP]
C97  10uF  value 0603  [0603 CAP SAMSUNG CL10C]
C98  100nF  value 0402  [0402 CAP]
C99  100nF  value 0402  [0402 CAP]
C100  10uF  value 0603  [0603 CAP SAMSUNG CL10C]
C101  10uF  value 0603  [0603 CAP SAMSUNG CL10C]
C102  10uF  value 0603  [0603 CAP SAMSUNG CL10C]
C103  100nF  value 0402  [0402 CAP]
C104  100nF  value 0402  [0402 CAP]
C105  10uF  value 0603  [0603 CAP SAMSUNG CL10C]
C108  100nF  value 0402  [0402 CAP]
C109  10uF  value 0603  [0603 CAP SAMSUNG CL10C]
C110  100nF  value 0402  [0402 CAP]
P49  Jumper  [HDR1X2]
P50  Jumper  [HDR1X2]
P51  Jumper  [HDR1X2]
R118  10K0  value 1%  [0402 RES]
R119  10K0  value 1%  [0402 RES]
R120  10K0  value 1%  [0402 RES]
R121  10K0  value 1%  [0402 RES]
R122  10K0  value 1%  [0402 RES]
R123  10K0  value 1%  [0402 RES]
R141  10K0  value 1%  [0402 RES]
U41  MCP33151-10-E/MS  [MSOP-10]
U42  MCP33151-10-E/MS  [MSOP-10]
U43  MCP33151-10-E/MS  [MSOP-10]

### Ports
AIN_HS_DE_FILTERED (in, see 10), AIN_HS_SE_FILTERED (in, see 9), AIN_LS_SE_FILTERED (in, see 11), SPI_ADC_HS_DE_nCS (in, see 5, 13), SPI_ADC_HS_DE_SDI (out, see 13), SPI_ADC_HS_SE_nCS (in), SPI_ADC_HS_SE_SDI (out, see 13), SPI_ADC_LS_SE_nCS (in, see 5, 13), SPI_ADC_LS_SE_SDI (out, see 13), SPI_ADC_SCLK (in, see 5, 13), SPI_ADC_SDO (out, see 5, 13)

### Nets
+1V8_A: C91.2 C96.2 C101.2 C108.2 C109.2 C110.2 U41.2(AVDD) U42.2(AVDD) U43.2(AVDD)
+3V3: C94.2 C95.2 C99.2 C100.2 C104.2 C105.2 R118.2 R119.2 R120.2 R121.2 R122.2 R123.2 R141.2 U41.10(DVIO) U42.10(DVIO) U43.10(DVIO)
+5V_A: C92.2 C93.2 C97.2 C98.2 C102.2 C103.2 U41.1(VREF) U42.1(VREF) U43.1(VREF)
GND: C91.1 C92.1 C93.1 C94.1 C95.1 C96.1 C97.1 C98.1 C99.1 C100.1 C101.1 C102.1 C103.1 C104.1 C105.1 C108.1 C109.1 C110.1 P49.2 P50.2 P51.2 U41.4(AIN-) U41.5(GND) U42.4(AIN-) U42.5(GND) U43.4(AIN-) U43.5(GND)
AIN_HS_DE_FILTERED: U42.3(AIN+) ; port AIN_HS_DE_FILTERED
AIN_HS_SE_FILTERED: U41.3(AIN+) ; port AIN_HS_SE_FILTERED
AIN_LS_SE_FILTERED: U43.3(AIN+) ; port AIN_LS_SE_FILTERED
SDI_HS_DE: P50.1 R121.1 U42.9(SDI) ; port SPI_ADC_HS_DE_SDI
SDI_HS_SE: P49.1 R119.1 U41.9(SDI) ; port SPI_ADC_HS_SE_SDI
SDI_LS_SE: P51.1 R122.1 U43.9(SDI) ; port SPI_ADC_LS_SE_SDI
SPI_ADC_HS_DE_nCS: R120.1 U42.6(CNVST) ; port SPI_ADC_HS_DE_nCS
SPI_ADC_HS_SE_nCS: R118.1 U41.6(CNVST) ; port SPI_ADC_HS_SE_nCS
SPI_ADC_LS_SE_nCS: R123.1 U43.6(CNVST) ; port SPI_ADC_LS_SE_nCS
SPI_ADC_SCLK: U41.8(SCLK) U42.8(SCLK) U43.8(SCLK) ; port SPI_ADC_SCLK
SPI_ADC_SDO: R141.1 U41.7(SDO) U42.7(SDO) U43.7(SDO) ; port SPI_ADC_SDO

### Notes on the sheet
- (near R141) R141 is an optional pull-up on SDO if BUSY bit is used. DNP by default.
- Label on silkscreen.
- Jumper option to pull SDI low (using BUSY bit on SDO). Default SDI is pulled high (no BUSY bit).
- Title
- Size:
- Date:
- B
- Revision:
- Time:
- Drawn By:
- Sheet
- of
- File:

### Library data of the parts
C91-C105 C108-C110 = Cap: Capacitor; Published: 8-Jun-2000; LatestRevisionDate: 17-Jul-2002; LatestRevisionNote: Re-released for DXP Platform.; PackageReference: RAD-0.3; Publisher: Altium Limited; PackageDescription: Radial Cap, Thru-Hole; 2 Leads; 0.3 in Pin Spacing
P49-P51 = Header 2: Header, 2-Pin; LatestRevisionDate: 17-Jul-2002; LatestRevisionNote: Re-released for DXP Platform.; Publisher: Altium Limited
R118-R123 R141 = Res1: Resistor; Published: 8-Jun-2000; LatestRevisionDate: 17-Jul-2002; LatestRevisionNote: Re-released for DXP Platform.; PackageReference: AXIAL-0.3; Publisher: Altium Limited; PackageDescription: Axial Device, Thru-Hole; 2 Leads; 0.3 in Pin Spacing
U41-U43 = ADC MCP33151: ADC 14-bit SAR 1Msps 10-MSOP; Manufacturer: Microchip; Supplier 1: Arrow Electronics; Manufacturer Part Number: MCP33151-10-E/MS; RoHS: No; Category: Analog to Digital Converters (ADCs); Stock 1: 90; Pricing 1: 1=2.20600 (USD); Supplier Part Number 1: MCP33151-10-E/MS

## Sheet Debug.SchDoc: Debug
size B; DrawnBy: Jasper Yun; SheetNumber: 13; SheetTotal: 13; Competition: SAC 2021; Subteam: Avionics; University: McGill University; Location: Montreal, Quebec; Project: Avionics Project Name; MRT: McGill Rocket Team
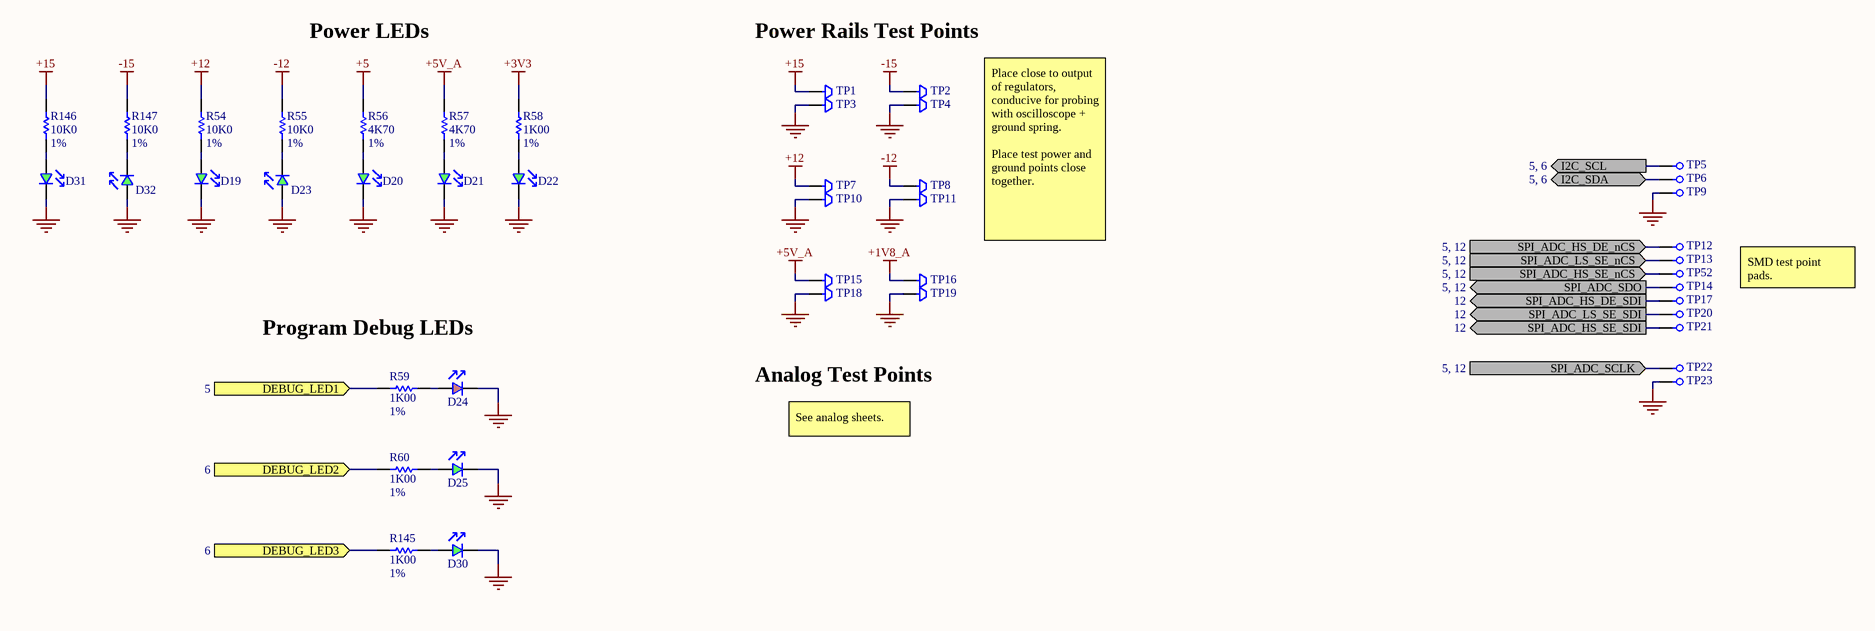
[diagram p12: Debug.SchDoc]

### Parts
D19  LED Green  [0603 LED]  (value not drawn)
D20  LED Green  [0603 LED]  (value not drawn)
D21  LED Green  [0603 LED]  (value not drawn)
D22  LED Green  [0603 LED]  (value not drawn)
D23  LED Green  [0603 LED]  (value not drawn)
D24  LED Red  [0603 LED]  (value not drawn)
D25  LED Green  [0603 LED]  (value not drawn)
D30  LED Green  [0603 LED]  (value not drawn)
D31  LED Green  [0603 LED]  (value not drawn)
D32  LED Green  [0603 LED]  (value not drawn)
R54  10K0  value 1%  [0402 RES]
R55  10K0  value 1%  [0402 RES]
R56  4K70  value 1%  [0402 RES]
R57  4K70  value 1%  [0402 RES]
R58  1K00  value 1%  [0402 RES]
R59  1K00  value 1%  [0402 RES]
R60  1K00  value 1%  [0402 RES]
R145  1K00  value 1%  [0402 RES]
R146  10K0  value 1%  [0402 RES]
R147  10K0  value 1%  [0402 RES]
TP1  Test Point - Keystone 5015  [Test Point Keystone 5015]  (value not drawn)
TP2  Test Point - Keystone 5015  [Test Point Keystone 5015]  (value not drawn)
TP3  Test Point - Keystone 5015  [Test Point Keystone 5015]  (value not drawn)
TP4  Test Point - Keystone 5015  [Test Point Keystone 5015]  (value not drawn)
TP5  Test Point - SMD Pad  [TEST POINT SMD PAD]  (value not drawn)  (no BOM)
TP6  Test Point - SMD Pad  [TEST POINT SMD PAD]  (value not drawn)  (no BOM)
TP7  Test Point - Keystone 5015  [Test Point Keystone 5015]  (value not drawn)
TP8  Test Point - Keystone 5015  [Test Point Keystone 5015]  (value not drawn)
TP9  Test Point - SMD Pad  [TEST POINT SMD PAD]  (value not drawn)  (no BOM)
TP10  Test Point - Keystone 5015  [Test Point Keystone 5015]  (value not drawn)
TP11  Test Point - Keystone 5015  [Test Point Keystone 5015]  (value not drawn)
TP12  Test Point - SMD Pad  [TEST POINT SMD PAD]  (value not drawn)  (no BOM)
TP13  Test Point - SMD Pad  [TEST POINT SMD PAD]  (value not drawn)  (no BOM)
TP14  Test Point - SMD Pad  [TEST POINT SMD PAD]  (value not drawn)  (no BOM)
TP15  Test Point - Keystone 5015  [Test Point Keystone 5015]  (value not drawn)
TP16  Test Point - Keystone 5015  [Test Point Keystone 5015]  (value not drawn)
TP17  Test Point - SMD Pad  [TEST POINT SMD PAD]  (value not drawn)  (no BOM)
TP18  Test Point - Keystone 5015  [Test Point Keystone 5015]  (value not drawn)
TP19  Test Point - Keystone 5015  [Test Point Keystone 5015]  (value not drawn)
TP20  Test Point - SMD Pad  [TEST POINT SMD PAD]  (value not drawn)  (no BOM)
TP21  Test Point - SMD Pad  [TEST POINT SMD PAD]  (value not drawn)  (no BOM)
TP22  Test Point - SMD Pad  [TEST POINT SMD PAD]  (value not drawn)  (no BOM)
TP23  Test Point - SMD Pad  [TEST POINT SMD PAD]  (value not drawn)  (no BOM)
TP52  Test Point - SMD Pad  [TEST POINT SMD PAD]  (value not drawn)  (no BOM)

### Ports
DEBUG_LED1 (in, see 5), DEBUG_LED2 (in, see 6), DEBUG_LED3 (in, see 6), I2C_SCL (out, see 5, 6), I2C_SDA (bidir, see 5, 6), SPI_ADC_HS_DE_nCS (in, see 5, 12), SPI_ADC_HS_DE_SDI (out, see 12), SPI_ADC_HS_SE_nCS (in, see 5, 12), SPI_ADC_HS_SE_SDI (out, see 12), SPI_ADC_LS_SE_nCS (in, see 5, 12), SPI_ADC_LS_SE_SDI (out, see 12), SPI_ADC_SCLK (in, see 5, 12), SPI_ADC_SDO (out, see 5, 12)

### Nets
+1V8_A: TP16.1
+3V3: R58.2
+5: R56.2
+5V_A: R57.2 TP15.1
+12: R54.2 TP7.1
+15: R146.2 TP1.1
-12: R55.2 TP8.1
-15: R147.2 TP2.1
GND: D19.2(Cathode) D20.2(Cathode) D21.2(Cathode) D22.2(Cathode) D23.1(Anode) D24.2(Cathode) D25.2(Cathode) D30.2(Cathode) D31.2(Cathode) D32.1(Anode) TP3.1 TP4.1 TP9.1 TP10.1 TP11.1 TP18.1 TP19.1 TP23.1
DEBUG_LED1: R59.2 ; port DEBUG_LED1
DEBUG_LED2: R60.2 ; port DEBUG_LED2
DEBUG_LED3: R145.2 ; port DEBUG_LED3
I2C_SCL: TP5.1 ; port I2C_SCL
I2C_SDA: TP6.1 ; port I2C_SDA
SDI_HS_DE: TP17.1 ; port SPI_ADC_HS_DE_SDI
SDI_HS_SE: TP21.1 ; port SPI_ADC_HS_SE_SDI
SDI_LS_SE: TP20.1 ; port SPI_ADC_LS_SE_SDI
SPI_ADC_HS_DE_nCS: TP12.1 ; port SPI_ADC_HS_DE_nCS
SPI_ADC_HS_SE_nCS: TP52.1 ; port SPI_ADC_HS_SE_nCS
SPI_ADC_LS_SE_nCS: TP13.1 ; port SPI_ADC_LS_SE_nCS
SPI_ADC_SCLK: TP22.1 ; port SPI_ADC_SCLK
SPI_ADC_SDO: TP14.1 ; port SPI_ADC_SDO
NetD19_1: D19.1(Anode) R54.1
NetD20_1: D20.1(Anode) R56.1
NetD21_1: D21.1(Anode) R57.1
NetD22_1: D22.1(Anode) R58.1
NetD23_2: D23.2(Cathode) R55.1
NetD24_1: D24.1(Anode) R59.1
NetD25_1: D25.1(Anode) R60.1
NetD30_1: D30.1(Anode) R145.1
NetD31_1: D31.1(Anode) R146.1
NetD32_2: D32.2(Cathode) R147.1

### Notes on the sheet
- Power LEDs
- Power Rails Test Points
- Place close to output of regulators, conducive for probing with oscilloscope + ground spring.
  Place test power and ground points close together.
- SMD test point pads.
- Program Debug LEDs
- Analog Test Points
- See analog sheets.
- Title
- Size:
- Date:
- B
- Revision:
- Time:
- Drawn By:
- Sheet
- of
- File:

### Library data of the parts
D19-D23 D25 D30-D32 = LED Green: Generic Green LED
D24 = LED Red: Generic Red LED
R54-R60 R145-R147 = Res1: Resistor; Published: 8-Jun-2000; LatestRevisionDate: 17-Jul-2002; LatestRevisionNote: Re-released for DXP Platform.; PackageReference: AXIAL-0.3; Publisher: Altium Limited; PackageDescription: Axial Device, Thru-Hole; 2 Leads; 0.3 in Pin Spacing
TP1-TP4 TP7 TP8 TP10 TP11 TP15 TP16 TP18 TP19 = Test Point - Keystone 5015: Keystone 5015 Test point
TP5 TP6 TP9 TP12-TP14 TP17 TP20-TP23 TP52 = Test Point - SMD Pad: SMD Pad test point